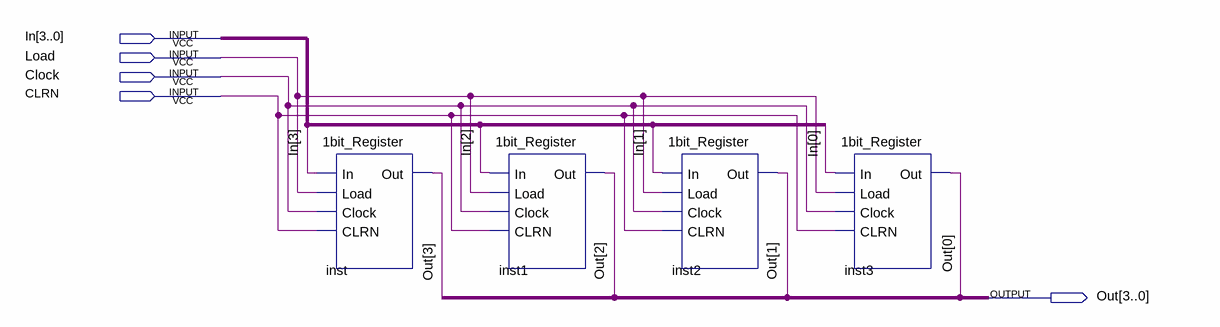
[diagram p0: schematic sheet]
// Quartus schematic 4bit_Register.bdf as structural Verilog: 4 symbols, 5 pins
module \4bit_Register  (
  input  [3:0] In,
  input  Load,
  input  Clock,
  input  CLRN,
  output [3:0] Out
);

  \1bit_Register  inst (.In(In[3]), .Load(Load), .Clock(Clock), .CLRN(CLRN), .Out(Out[3]));
  \1bit_Register  inst1 (.In(In[2]), .Load(Load), .Clock(Clock), .CLRN(CLRN), .Out(Out[2]));
  \1bit_Register  inst2 (.In(In[1]), .Load(Load), .Clock(Clock), .CLRN(CLRN), .Out(Out[1]));
  \1bit_Register  inst3 (.In(In[0]), .Load(Load), .Clock(Clock), .CLRN(CLRN), .Out(Out[0]));
endmodule
